# Altium schematic sheet Main.SchDoc: Плата
size 594 x 420 mm; CompanyName: ООО "ЛАССАРД"; Address1: Address1; Address2: Address2; Address3: Address3; Address4: Address4; DocumentNumber: *Э3; SheetNumber: 1; SheetTotal: 11; Title2str: управления; DocumentType: Схема электрическая принципиальная
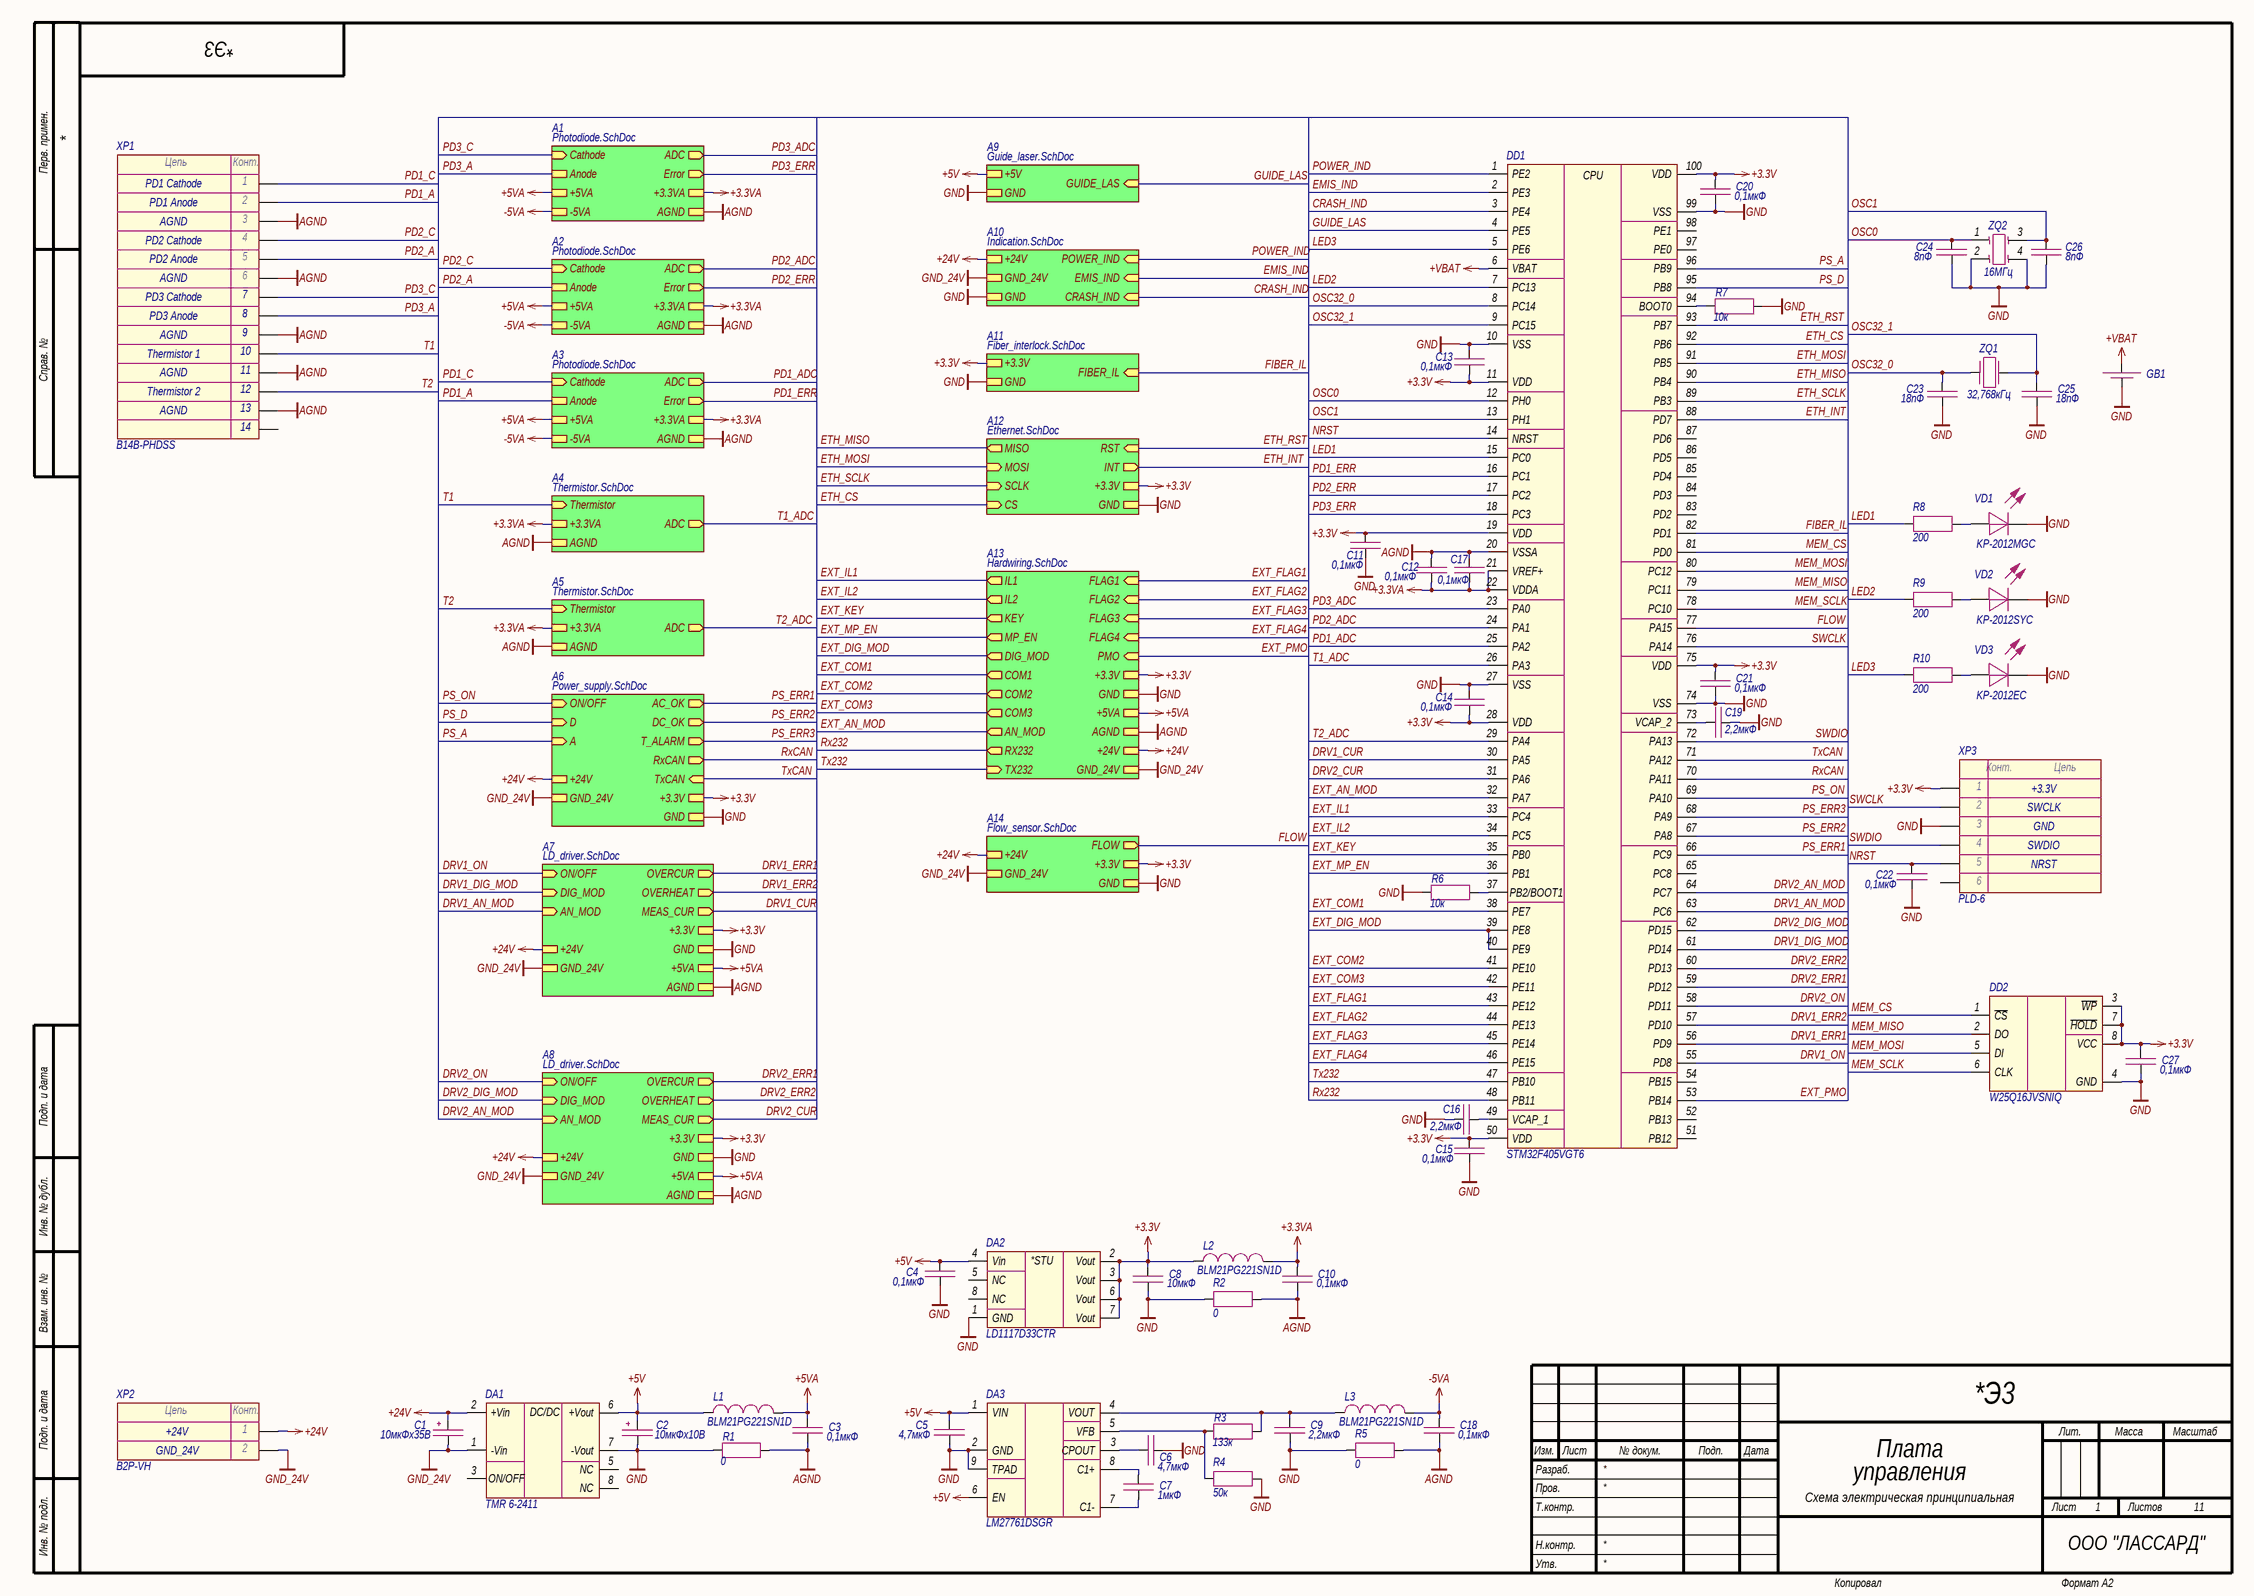
[diagram p0: Main.SchDoc]

## Parts
C1  10мкФх35B  [CAP_C]
C2  10мкФх10B  [CAP_A]
C3  0,1мкФ  [CAP_0603]
C4  0,1мкФ  [CAP_0603]
C5  4,7мкФ  [CAP_0603]
C6  4,7мкФ  [CAP_0603]
C7  1мкФ  [CAP_0603]
C8  10мкФ  [CAP_0603]
C9  2,2мкФ  [CAP_0603]
C10  0,1мкФ  [CAP_0603]
C11  0,1мкФ  [CAP_0603]
C12  0,1мкФ  [CAP_0603]
C13  0,1мкФ  [CAP_0603]
C14  0,1мкФ  [CAP_0603]
C15  0,1мкФ  [CAP_0603]
C16  2,2мкФ  [CAP_0603]
C17  0,1мкФ  [CAP_0603]
C18  0,1мкФ  [CAP_0603]
C19  2,2мкФ  [CAP_0603]
C20  0,1мкФ  [CAP_0603]
C21  0,1мкФ  [CAP_0603]
C22  0,1мкФ  [CAP_0603]
C23  18пФ  [CAP_0603]
C24  8пФ  [CAP_0603]
C25  18пФ  [CAP_0603]
C26  8пФ  [CAP_0603]
C27  0,1мкФ  [CAP_0603]
DA1  TMR 6-2411  [TMR3 (SIP-8)]
DA2  LD1117D33CTR  [SOIC-8]
DA3  LM27761DSGR  [WSON-8]
DD1  STM32F405VGT6  [LQFP-100]
DD2  W25Q16JVSNIQ  [SOIC-8]
GB1  DS1092-12-N8S  [DS1092-12-N8S]  (value not drawn)
L1  BLM21PG221SN1D  [IND_0805]
L2  BLM21PG221SN1D  [IND_0805]
L3  BLM21PG221SN1D  [IND_0805]
R1  0  [RES_0805]
R2  0  [RES_0805]
R3  133к  [RES_0603]
R4  50к  [RES_0603]
R5  0  [RES_0805]
R6  10к  [RES_0603]
R7  10к  [RES_0603]
R8  200  [RES_0603]
R9  200  [RES_0603]
R10  200  [RES_0603]
VD1  KP-2012MGC  [LED_0805]
VD2  KP-2012SYC  [LED_0805]
VD3  KP-2012EC  [LED_0805]
XP1  B14B-PHDSS  [B14B-PHDSS]
XP2  B2P-VH  [B2P-VH]
XP3  PLD-6  [PLD-6]
ZQ1  32,768кГц  [NX3215SA]
ZQ2  16МГц  [NX2520SA]

## Sub-sheets
A1 = Photodiode.SchDoc: Cathode (in), ADC (out), Error (out), AGND, +5VA, +3.3VA, -5VA, Anode
A2 = Photodiode.SchDoc: Cathode (in), ADC (out), Error (out), AGND, +5VA, +3.3VA, -5VA, Anode
A3 = Photodiode.SchDoc: Cathode (in), ADC (out), Error (out), AGND, +5VA, +3.3VA, -5VA, Anode
A4 = Thermistor.SchDoc: Thermistor (in), +3.3VA, AGND, ADC (out)
A5 = Thermistor.SchDoc: Thermistor (in), +3.3VA, AGND, ADC (out)
A6 = Power_supply.SchDoc: ON/OFF (in), D (in), +3.3V, GND, +24V, GND_24V, AC_OK (out), DC_OK (out), RxCAN (out), TxCAN (in), T_ALARM (out), A (in)
A7 = LD_driver.SchDoc: +3.3V, GND, OVERCUR (out), OVERHEAT (out), +24V, GND_24V, ON/OFF (in), DIG_MOD (in), AN_MOD (in), MEAS_CUR (out), +5VA, AGND
A8 = LD_driver.SchDoc: +3.3V, GND, OVERCUR (out), OVERHEAT (out), +24V, GND_24V, ON/OFF (in), DIG_MOD (in), AN_MOD (in), MEAS_CUR (out), +5VA, AGND
A9 = Guide_laser.SchDoc: GUIDE_LAS (in), +5V, GND
A10 = Indication.SchDoc: GND_24V, +24V, CRASH_IND (in), POWER_IND (in), EMIS_IND (in), GND
A11 = Fiber_interlock.SchDoc: FIBER_IL (in), +3.3V, GND
A12 = Ethernet.SchDoc: MISO (out), RST (in), MOSI (in), INT (out), SCLK (in), CS (in), +3.3V, GND
A13 = Hardwiring.SchDoc: IL1 (out), FLAG1 (in), RX232 (out), TX232 (in), IL2 (out), KEY (out), MP_EN (out), AN_MOD (out), FLAG2 (in), FLAG3 (in), FLAG4 (in), PMO (in), COM1 (out), COM2 (out), COM3 (out), DIG_MOD (out), AGND, +3.3V, GND, GND_24V, +24V, +5VA
A14 = Flow_sensor.SchDoc: FLOW (out), +24V, GND_24V, +3.3V, GND

## Nets
+3.3V: C8.1 C11.1 C13.2 C14.2 C15.2 C20.1 C21.1 C27.1 DA2.2(Vout) DA2.3(Vout) DA2.6(Vout) DA2.7(Vout) DD1.11(VDD) DD1.19(VDD) DD1.28(VDD) DD1.50(VDD) DD1.75(VDD) DD1.100(VDD) DD2.3(~{WP}) DD2.7(~{HOLD}) DD2.8(VCC) L2.1 XP3.1 ; sheet A13/+3.3V, sheet A12/+3.3V, sheet A6/+3.3V, sheet A7/+3.3V, sheet A11/+3.3V, sheet A14/+3.3V, sheet A8/+3.3V
+3.3VA: C10.1 C12.2 C17.2 DD1.21(VREF+) DD1.22(VDDA) L2.2 ; sheet A1/+3.3VA, sheet A4/+3.3VA, sheet A2/+3.3VA, sheet A5/+3.3VA, sheet A3/+3.3VA
+5V: C2.1 C4.2 C5.1 DA1.6(+Vout) DA2.4(Vin) DA3.1(VIN) DA3.6(EN) L1.1 ; sheet A9/+5V
+5VA: C3.1 L1.2 ; sheet A13/+5VA, sheet A1/+5VA, sheet A7/+5VA, sheet A2/+5VA, sheet A3/+5VA, sheet A8/+5VA
+24V: C1.1 DA1.2(+Vin) XP2.1 ; sheet A10/+24V, sheet A13/+24V, sheet A6/+24V, sheet A7/+24V, sheet A14/+24V, sheet A8/+24V
+VBAT: DD1.6(VBAT) GB1.2
-5VA: C18.1 L3.2 ; sheet A1/-5VA, sheet A2/-5VA, sheet A3/-5VA
AGND: C3.2 C10.2 C12.1 C17.1 C18.2 DD1.20(VSSA) R1.2 R2.2 R5.2 XP1.3 XP1.6 XP1.9 XP1.11 XP1.13 ; sheet A13/AGND, sheet A1/AGND, sheet A4/AGND, sheet A7/AGND, sheet A2/AGND, sheet A5/AGND, sheet A3/AGND, sheet A8/AGND
GND: C2.2 C4.1 C5.2 C6.2 C8.2 C9.2 C11.2 C13.1 C14.1 C15.1 C16.2 C19.2 C20.2 C21.2 C22.2 C23.2 C24.2 C25.2 C26.2 C27.2 DA1.7(-Vout) DA2.1(GND) DA3.2(GND) DA3.9(TPAD) DD1.10(VSS) DD1.27(VSS) DD1.74(VSS) DD1.99(VSS) DD2.4(GND) GB1.1 R1.1 R2.1 R4.1 R5.1 R6.2 R7.2 VD1.2(C) VD2.2(C) VD3.2(C) XP3.3 ZQ2.2 ZQ2.4 ; sheet A10/GND, sheet A13/GND, sheet A12/GND, sheet A6/GND, sheet A7/GND, sheet A9/GND, sheet A11/GND, sheet A14/GND, sheet A8/GND
GND_24V: C1.2 DA1.1(-Vin) XP2.2 ; sheet A10/GND_24V, sheet A13/GND_24V, sheet A6/GND_24V, sheet A7/GND_24V, sheet A14/GND_24V, sheet A8/GND_24V
CRASH_IND: DD1.3(PE4) ; sheet A10/CRASH_IND
DRV1_AN_MOD: DD1.63(PC6) ; sheet A7/AN_MOD
DRV1_CUR: DD1.30(PA5) ; sheet A7/MEAS_CUR
DRV1_DIG_MOD: DD1.61(PD14) ; sheet A7/DIG_MOD
DRV1_ERR1: DD1.56(PD9) ; sheet A7/OVERCUR
DRV1_ERR2: DD1.57(PD10) ; sheet A7/OVERHEAT
DRV1_ON: DD1.55(PD8) ; sheet A7/ON/OFF
DRV2_AN_MOD: DD1.64(PC7) ; sheet A8/AN_MOD
DRV2_CUR: DD1.31(PA6) ; sheet A8/MEAS_CUR
DRV2_DIG_MOD: DD1.62(PD15) ; sheet A8/DIG_MOD
DRV2_ERR1: DD1.59(PD12) ; sheet A8/OVERCUR
DRV2_ERR2: DD1.60(PD13) ; sheet A8/OVERHEAT
DRV2_ON: DD1.58(PD11) ; sheet A8/ON/OFF
EMIS_IND: DD1.2(PE3) ; sheet A10/EMIS_IND
ETH_CS: DD1.92(PB6) ; sheet A12/CS
ETH_INT: DD1.88(PD7) ; sheet A12/INT
ETH_MISO: DD1.90(PB4) ; sheet A12/MISO
ETH_MOSI: DD1.91(PB5) ; sheet A12/MOSI
ETH_RST: DD1.93(PB7) ; sheet A12/RST
ETH_SCLK: DD1.89(PB3) ; sheet A12/SCLK
EXT_AN_MOD: DD1.32(PA7) ; sheet A13/AN_MOD
EXT_COM1: DD1.38(PE7) ; sheet A13/COM1
EXT_COM2: DD1.41(PE10) ; sheet A13/COM2
EXT_COM3: DD1.42(PE11) ; sheet A13/COM3
EXT_DIG_MOD: DD1.39(PE8) DD1.40(PE9) ; sheet A13/DIG_MOD
EXT_FLAG1: DD1.43(PE12) ; sheet A13/FLAG1
EXT_FLAG2: DD1.44(PE13) ; sheet A13/FLAG2
EXT_FLAG3: DD1.45(PE14) ; sheet A13/FLAG3
EXT_FLAG4: DD1.46(PE15) ; sheet A13/FLAG4
EXT_IL1: DD1.33(PC4) ; sheet A13/IL1
EXT_IL2: DD1.34(PC5) ; sheet A13/IL2
EXT_KEY: DD1.35(PB0) ; sheet A13/KEY
EXT_MP_EN: DD1.36(PB1) ; sheet A13/MP_EN
EXT_PMO: DD1.53(PB14) ; sheet A13/PMO
FIBER_IL: DD1.82(PD1) ; sheet A11/FIBER_IL
FLOW: DD1.77(PA15) ; sheet A14/FLOW
GUIDE_LAS: DD1.4(PE5) ; sheet A9/GUIDE_LAS
LED1: DD1.15(PC0) R8.1
LED2: DD1.7(PC13) R9.1
LED3: DD1.5(PE6) R10.1
MEM_CS: DD1.81(PD0) DD2.1(~{CS})
MEM_MISO: DD1.79(PC11) DD2.2(DO)
MEM_MOSI: DD1.80(PC12) DD2.5(DI)
MEM_SCLK: DD1.78(PC10) DD2.6(CLK)
NRST: C22.1 DD1.14(NRST) XP3.5
OSC0: C24.1 DD1.12(PH0) ZQ2.1
OSC1: C26.1 DD1.13(PH1) ZQ2.3
OSC32_0: C23.1 DD1.8(PC14) ZQ1.1
OSC32_1: C25.1 DD1.9(PC15) ZQ1.2
PD1_A: XP1.2 ; sheet A3/Anode
PD1_ADC: DD1.25(PA2) ; sheet A3/ADC
PD1_C: XP1.1 ; sheet A3/Cathode
PD1_ERR: DD1.16(PC1) ; sheet A3/Error
PD2_A: XP1.5 ; sheet A2/Anode
PD2_ADC: DD1.24(PA1) ; sheet A2/ADC
PD2_C: XP1.4 ; sheet A2/Cathode
PD2_ERR: DD1.17(PC2) ; sheet A2/Error
PD3_A: XP1.8 ; sheet A1/Anode
PD3_ADC: DD1.23(PA0) ; sheet A1/ADC
PD3_C: XP1.7 ; sheet A1/Cathode
PD3_ERR: DD1.18(PC3) ; sheet A1/Error
POWER_IND: DD1.1(PE2) ; sheet A10/POWER_IND
PS_A: DD1.96(PB9) ; sheet A6/A
PS_D: DD1.95(PB8) ; sheet A6/D
PS_ERR1: DD1.66(PC9) ; sheet A6/AC_OK
PS_ERR2: DD1.67(PA8) ; sheet A6/DC_OK
PS_ERR3: DD1.68(PA9) ; sheet A6/T_ALARM
PS_ON: DD1.69(PA10) ; sheet A6/ON/OFF
Rx232: DD1.48(PB11) ; sheet A13/RX232
RxCAN: DD1.70(PA11) ; sheet A6/RxCAN
SWCLK: DD1.76(PA14) XP3.2
SWDIO: DD1.72(PA13) XP3.4
T1: XP1.10 ; sheet A4/Thermistor
T1_ADC: DD1.26(PA3) ; sheet A4/ADC
T2: XP1.12 ; sheet A5/Thermistor
T2_ADC: DD1.29(PA4) ; sheet A5/ADC
Tx232: DD1.47(PB10) ; sheet A13/TX232
TxCAN: DD1.71(PA12) ; sheet A6/TxCAN
NetC6_1: C6.1 DA3.3(CPOUT)
NetC7_1: C7.1 DA3.8(C1+)
NetC7_2: C7.2 DA3.7(C1-)
NetC9_1: C9.1 DA3.4(VOUT) L3.1 R3.2
NetC16_1: C16.1 DD1.49(VCAP_1)
NetC19_1: C19.1 DD1.73(VCAP_2)
NetDA3_5: DA3.5(VFB) R3.1 R4.2
NetDD1_37: DD1.37(PB2/BOOT1) R6.1
NetDD1_94: DD1.94(BOOT0) R7.1
NetR8_2: R8.2 VD1.1(A)
NetR9_2: R9.2 VD2.1(A)
NetR10_2: R10.2 VD3.1(A)

Not connected (* = marked no-connect by the designer): DA1 3(ON/OFF) 5(NC) 8(NC); DA2 5(NC) 8(NC); DD1 51(PB12) 52(PB13) 54(PB15) 65(PC8) 83(PD2) 84(PD3) 85(PD4) 86(PD5) 87(PD6) 97(PE0) 98(PE1); XP1 14; XP3 6

## Notes on the sheet
- PD1 Cathode
- PD1 Anode
- AGND
- PD2 Anode
- PD2 Cathode
- PD3 Anode
- PD3 Cathode
- Thermistor 1
- Thermistor 2
- +3.3V
- SWCLK
- GND
- SWDIO
- NRST
- +24V
- GND_24V
- Перв. примен.
- Справ. №
- Подп. и дата
- Инв. № дубл.
- Взам. инв. №
- Разраб.
- Изм.
- Лист
- № докум.
- Подп.
- Дата
- Лит.
- Масса
- Масштаб
- Пров.
- Т.контр.
- Листов
- Инв. № подл.
- Утв.
- Н.контр.
- Копировал
- Формат А2
- (in symbol Connector-2) Цепь; Конт.
- (in symbol Connector-6) Конт.; Цепь
- (in symbol Connector-14) Цепь; Конт.
- (in symbol LD1117D33) *STU
- (in symbol STM32F405VG) CPU
- (in symbol TMR3) DC/DC

## Library data of the parts
C1 = Capacitor_Polar: Model: TECAP, 10 мкФ, 35 В, тип C, 10%; Value: 10мкФх35B; Document: *; Manufacturer: *
C2 = Capacitor_Polar: Model: TECAP, 10 мкФ, 10 В, тип A, 10%; Value: 10мкФх10B; Document: *; Manufacturer: *
C3 C4 C10-C15 C17 C18 C20-C22 C27 = Capacitor: Manufacturer: Murata; Model: GRM188R71H104KA93D; Value: 0,1мкФ; Document: *
C5 C6 = Capacitor: Manufacturer: Murata; Model: GRM188R6YA475KE15D; Value: 4,7мкФ; Document: *
C7 = Capacitor: Manufacturer: Murata; Model: GRM188R61H105KAALD; Value: 1мкФ; Document: *
C8 = Capacitor: Manufacturer: Murata; Model: GRM188R61E106KA73D; Value: 10мкФ; Document: *
C9 C16 C19 = Capacitor: Manufacturer: Murata; Model: GRM188R61H225KE11D; Value: 2,2мкФ; Document: *
C23 C25 = Capacitor: Manufacturer: Murata; Model: GRM1885C1H180FA01D; Value: 18пФ; Document: *
C24 C26 = Capacitor: Manufacturer: Yageo; Model: CC0603CRNPO9BN8R0; Value: 8пФ; Document: *
DA1 = TMR3: Manufacturer: Traco Power; Model: TMR 6-2411; Document: *
DA2 = LD1117D33: Manufacturer: STMicroelectronics; Model: LD1117D33CTR; Document: *
DA3 = LM27761: Manufacturer: Texas Instruments; Model: LM27761DSGR; Document: *
DD1 = STM32F405VG: Manufacturer: STMicroelectronics; Model: STM32F405VGT6; Document: *
DD2 = W25Q: Manufacturer: Winbond; Model: W25Q16JVSNIQ; Document: *
GB1 = Accumulator: Manufacturer: Connfly; Model: DS1092-12-N8S; Document: *
L1-L3 = Inductor: Manufacturer: Murata; Value: *; Model: BLM21PG221SN1D; Document: *
R1 R2 R5 = Resistor: Manufacturer: Yageo; Model: RC0805FR-070RL; Value: 0; Document: *
R3 = Resistor: Manufacturer: Yageo; Model: RC0603FR-07133KL; Value: 133к; Document: *
R4 = Resistor: Manufacturer: Yageo; Model: RT0603BRD0750KL; Value: 50к; Document: *
R6 R7 = Resistor: Manufacturer: Yageo; Model: RC0603FR-0710KL; Value: 10к; Document: *
R8-R10 = Resistor: Manufacturer: Yageo; Model: RC0603FR-07200RL; Value: 200; Document: *
VD1-VD3 = LED: Manufacturer: Kingbright; Document: *
  VD1: Model: KP-2012MGC
  VD2: Model: KP-2012SYC
  VD3: Model: KP-2012EC
XP1 = Connector-14: Manufacturer: JST; Model: B14B-PHDSS; Document: *
XP2 = Connector-2: Manufacturer: JST; Model: B2P-VH; Document: *
XP3 = Connector-6: Manufacturer: Connfly; Model: PLD-6; Document: *
ZQ1 = Quartz_Resonator: Manufacturer: NDK; Model: NX3215SA- 32.768K-STD-MUA-8; Value: 32,768кГц; Document: *
ZQ2 = Quartz_Resonator_4-pin: Manufacturer: NDK; Model: NX2520SA-16MHZ-STD-CSW-5; Value: 16МГц; Document: *